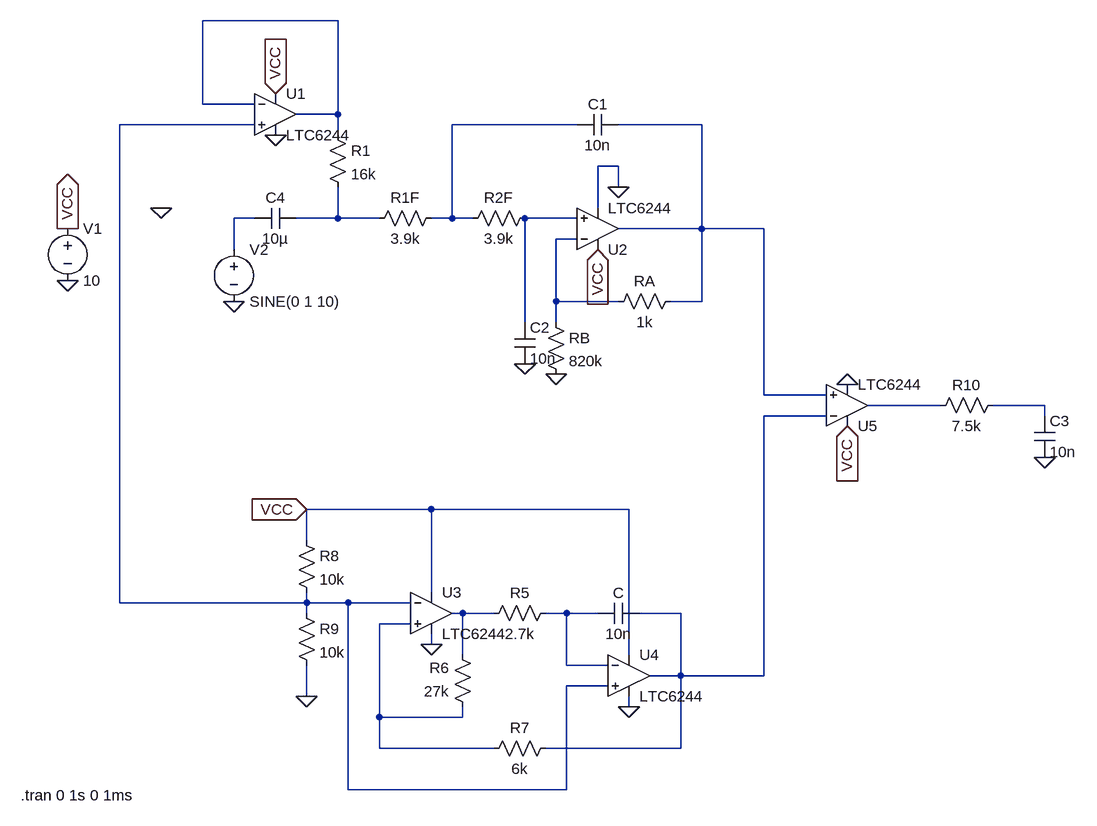
[diagram p0: schematic FinalDesign.asc]
FinalDesign.asc, the LTspice schematic file:
Version 4
SHEET 1 1496 904
WIRE 336 -304 128 -304
WIRE 128 -176 128 -304
WIRE 208 -176 128 -176
WIRE 336 -160 336 -304
WIRE 336 -160 272 -160
WIRE 208 -144 0 -144
WIRE 704 -144 512 -144
WIRE 896 -144 768 -144
WIRE 336 -128 336 -160
WIRE 768 -80 736 -80
WIRE 768 -48 768 -80
WIRE 736 -16 736 -80
WIRE 208 0 176 0
WIRE 336 0 336 -48
WIRE 336 0 272 0
WIRE 400 0 336 0
WIRE 512 0 512 -144
WIRE 512 0 480 0
WIRE 544 0 512 0
WIRE 704 0 624 0
WIRE 896 16 896 -144
WIRE 896 16 768 16
WIRE 992 16 896 16
WIRE 704 32 672 32
WIRE 176 48 176 0
WIRE 672 128 672 32
WIRE 768 128 672 128
WIRE 896 128 896 16
WIRE 896 128 848 128
WIRE 624 160 624 0
WIRE 672 160 672 128
WIRE 992 272 992 16
WIRE 1088 272 992 272
WIRE 1264 288 1152 288
WIRE 1424 288 1344 288
WIRE 1088 304 992 304
WIRE 1424 304 1424 288
WIRE 480 448 288 448
WIRE 784 448 480 448
WIRE 288 496 288 448
WIRE 480 576 480 448
WIRE 0 592 0 -144
WIRE 288 592 288 576
WIRE 288 592 0 592
WIRE 352 592 288 592
WIRE 448 592 352 592
WIRE 288 608 288 592
WIRE 528 608 512 608
WIRE 576 608 528 608
WIRE 688 608 656 608
WIRE 736 608 688 608
WIRE 864 608 800 608
WIRE 448 624 400 624
WIRE 480 656 480 640
WIRE 528 672 528 608
WIRE 784 672 784 448
WIRE 688 688 688 608
WIRE 752 688 688 688
WIRE 864 704 864 608
WIRE 864 704 816 704
WIRE 992 704 992 304
WIRE 992 704 864 704
WIRE 752 720 688 720
WIRE 288 736 288 688
WIRE 784 752 784 736
WIRE 400 768 400 624
WIRE 528 768 528 752
WIRE 528 768 400 768
WIRE 400 816 400 768
WIRE 576 816 400 816
WIRE 864 816 864 704
WIRE 864 816 656 816
WIRE 352 880 352 592
WIRE 688 880 688 720
WIRE 688 880 352 880
FLAG -80 96 0
FLAG -80 16 VCC
IOPIN -80 16 Out
FLAG 1120 320 VCC
IOPIN 1120 320 In
FLAG 1120 256 0
FLAG 288 736 0
FLAG 480 656 0
FLAG 784 752 0
FLAG 1424 368 0
FLAG 176 128 0
FLAG 240 -192 VCC
IOPIN 240 -192 In
FLAG 240 -128 0
FLAG 288 448 VCC
IOPIN 288 448 In
FLAG 736 48 VCC
IOPIN 736 48 In
FLAG 768 -48 0
FLAG 624 224 0
FLAG 672 240 0
FLAG 64 -16 0
SYMBOL voltage -80 0 R0
WINDOW 123 0 0 Left 0
WINDOW 39 0 0 Left 0
SYMATTR InstName V1
SYMATTR Value 10
SYMBOL Opamps\\LTC6244 1120 288 M180
SYMATTR InstName U5
SYMBOL res 672 592 R90
WINDOW 0 0 56 VBottom 2
WINDOW 3 32 56 VTop 2
SYMATTR InstName R5
SYMATTR Value 2.7k
SYMBOL res 544 768 R180
WINDOW 0 36 76 Left 2
WINDOW 3 36 40 Left 2
SYMATTR InstName R6
SYMATTR Value 27k
SYMBOL res 672 800 R90
WINDOW 0 0 56 VBottom 2
WINDOW 3 32 56 VTop 2
SYMATTR InstName R7
SYMATTR Value 6k
SYMBOL cap 800 592 R90
WINDOW 0 0 32 VBottom 2
WINDOW 3 32 32 VTop 2
SYMATTR InstName C
SYMATTR Value 10n
SYMBOL res 272 480 R0
SYMATTR InstName R8
SYMATTR Value 10k
SYMBOL res 272 592 R0
SYMATTR InstName R9
SYMATTR Value 10k
SYMBOL OpAmps\\LTC6244 480 608 R0
SYMATTR InstName U3
SYMBOL OpAmps\\LTC6244 784 704 R0
SYMATTR InstName U4
SYMBOL cap 1408 304 R0
SYMATTR InstName C3
SYMATTR Value 10n
SYMBOL res 1360 272 R90
WINDOW 0 0 56 VBottom 2
WINDOW 3 32 56 VTop 2
SYMATTR InstName R10
SYMATTR Value 7.5k
SYMBOL res 320 -144 R0
SYMATTR InstName R1
SYMATTR Value 16k
SYMBOL cap 272 -16 R90
WINDOW 0 0 32 VBottom 2
WINDOW 3 32 32 VTop 2
SYMATTR InstName C4
SYMATTR Value 10µ
SYMBOL voltage 176 32 R0
WINDOW 123 0 0 Left 0
WINDOW 39 0 0 Left 0
SYMATTR InstName V2
SYMATTR Value SINE(0 1 10)
SYMBOL OpAmps\\LTC6244 240 -160 R0
SYMATTR InstName U1
SYMBOL OpAmps\\LTC6244 736 16 M180
SYMATTR InstName U2
SYMBOL cap 768 -160 R90
WINDOW 0 0 32 VBottom 2
WINDOW 3 32 32 VTop 2
SYMATTR InstName C1
SYMATTR Value 10n
SYMBOL res 640 -16 R90
WINDOW 0 0 56 VBottom 2
WINDOW 3 32 56 VTop 2
SYMATTR InstName R2F
SYMATTR Value 3.9k
SYMBOL res 496 -16 R90
WINDOW 0 0 56 VBottom 2
WINDOW 3 32 56 VTop 2
SYMATTR InstName R1F
SYMATTR Value 3.9k
SYMBOL res 864 112 R90
WINDOW 0 0 56 VBottom 2
WINDOW 3 32 56 VTop 2
SYMATTR InstName RA
SYMATTR Value 1k
SYMBOL res 656 144 R0
SYMATTR InstName RB
SYMATTR Value 820k
SYMBOL cap 608 160 R0
SYMATTR InstName C2
SYMATTR Value 10n
TEXT -152 888 Left 2 !.tran 0 1s 0 1ms

The netlist it stands for:
* FinalDesign.asc
V1 VCC 0 10
XU5 N004 N011 VCC 0 N009 LTC6244  ; pins In+ In- V+ V- OUT
R5 N013 N012 2.7k
R6 N014 N012 27k
R7 N011 N014 6k
C N011 N013 10n
R8 VCC N002 10k
R9 N002 0 10k
XU3 N014 N002 VCC 0 N012 LTC6244  ; pins In+ In- V+ V- OUT
XU4 N002 N013 VCC 0 N011 LTC6244  ; pins In+ In- V+ V- OUT
C3 N010 0 10n
R10 N010 N009 7.5k
R1 N001 N006 16k
C4 N006 N005 10µ
V2 N005 0 SINE(0 1 10)
XU1 N002 N001 VCC 0 N001 LTC6244  ; pins In+ In- V+ V- OUT
XU2 N007 N008 VCC 0 N004 LTC6244  ; pins In+ In- V+ V- OUT
C1 N004 N003 10n
R2F N007 N003 3.9k
R1F N003 N006 3.9k
RA N004 N008 1k
RB N008 0 820k
C2 N007 0 10n
.tran 0 1s 0 1ms
.backanno
.end